# Altium project MiniPC MB GOST.PrjPcb (part 3 of 31)

## Sheet DRAM DDR4 Bank 2 Connector.SchDoc
size 594 x 420 mm; Author: ALTIUM GOSTBOM2.0 KEV; SheetNumber: 7; SheetTotal: 48
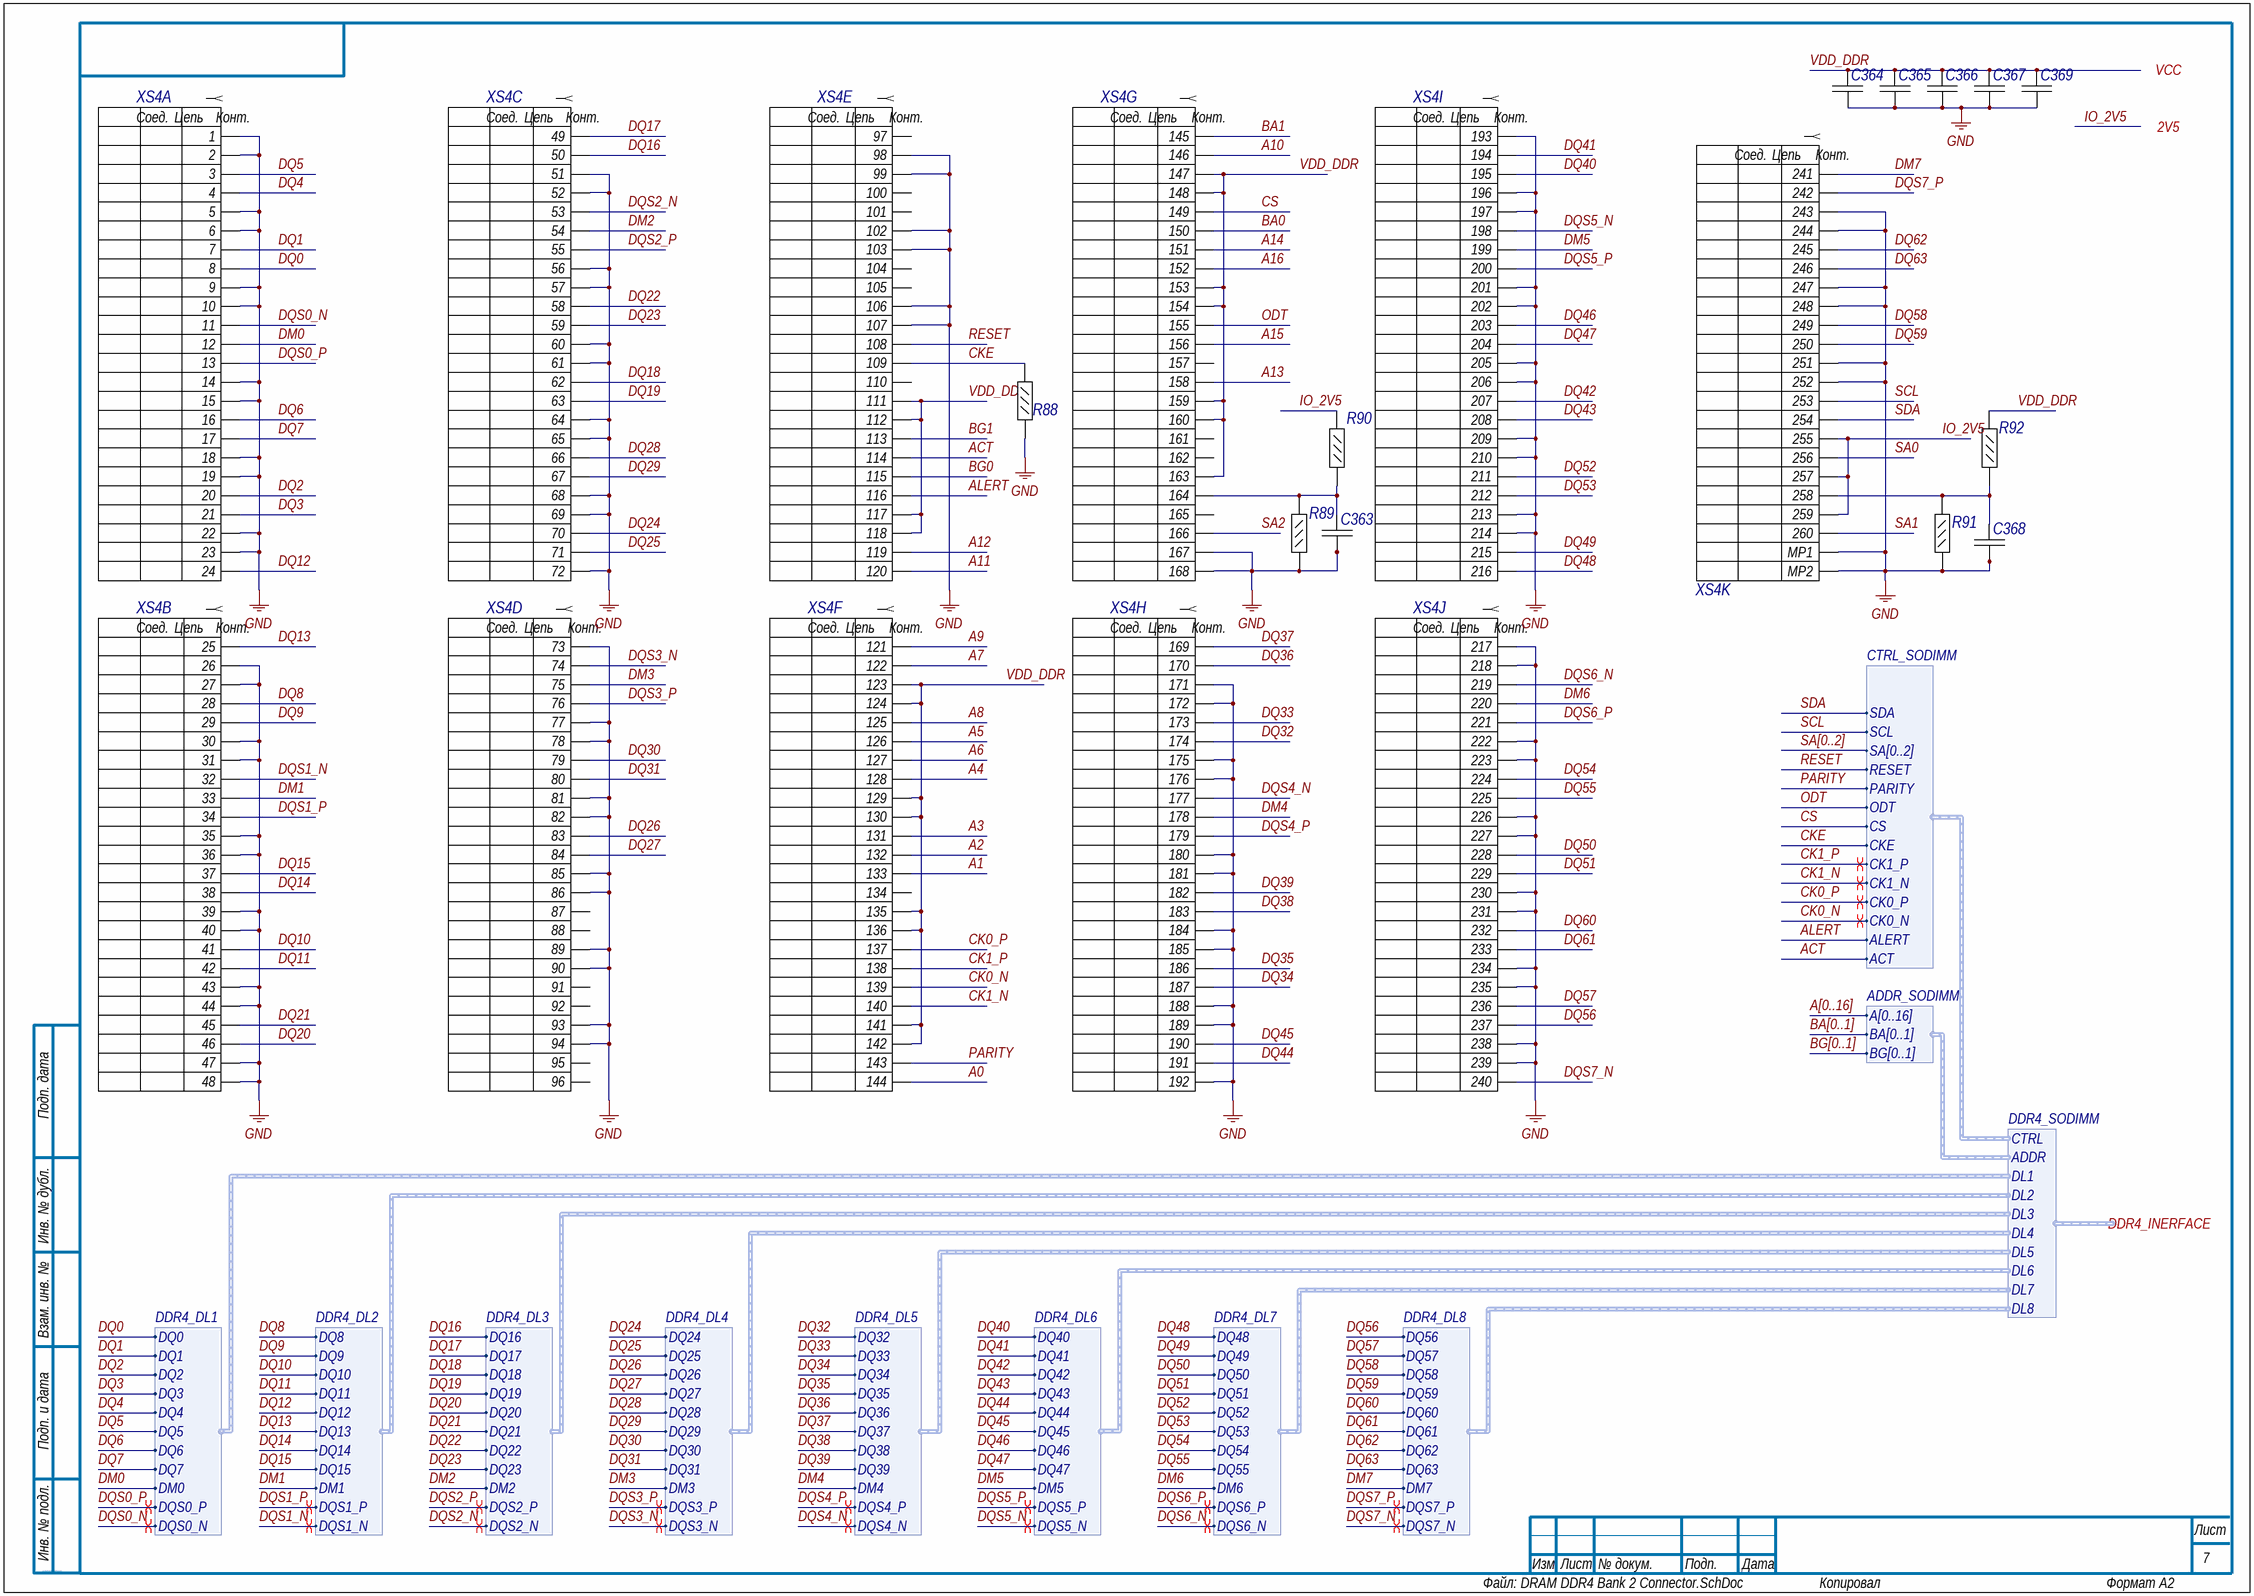
[diagram p4: DRAM DDR4 Bank 2 Connector.SchDoc]

### Parts
C363  C1005X7R1E104M  [CAPC1005X55X10LL05]  (value not drawn)
C364  C1005X7R1E104M  [CAPC1005X55X10LL05]  (value not drawn)
C365  C1005X7R1E104M  [CAPC1005X55X10LL05]  (value not drawn)
C366  C1005X7R1E104M  [CAPC1005X55X10LL05]  (value not drawn)
C367  C1005X7R1E104M  [CAPC1005X55X10LL05]  (value not drawn)
C368  C1005X7R1E104M  [CAPC1005X55X10LL05]  (value not drawn)
C369  C1005X7R1E104M  [CAPC1005X55X10LL05]  (value not drawn)
R88  RC0402JR-0739RL  [RESC1005X40X25LL05T05]  (value not drawn)
R89  RC0402JR-0739RL  [RESC1005X40X25LL05T05]  (value not drawn)
R90  RC0402JR-0739RL  [RESC1005X40X25LL05T05]  (value not drawn)
R91  RC0402JR-0739RL  [RESC1005X40X25LL05T05]  (value not drawn)
R92  RC0402JR-0739RL  [RESC1005X40X25LL05T05]  (value not drawn)
XS4  AS0A823-H4SB-7H  [FOXC-AS0A823-H4SB-7H_V]  (value not drawn)  (parts A,B,C,D,E,F,G,H,I,J,K of 11)

### Ports
2V5, DDR4_INERFACE (harness DDR4_SODIMM), VCC

### Harnesses
DDR4_DL1: DQ0, DQ1, DQ2, DQ3, DQ4, DQ5, DQ6, DQ7, DM0, DQS0_P, DQS0_N
DDR4_DL2: DQ8, DQ9, DQ10, DQ11, DQ12, DQ13, DQ14, DQ15, DM1, DQS1_P, DQS1_N
DDR4_DL3: DQ16, DQ17, DQ18, DQ19, DQ20, DQ21, DQ22, DQ23, DM2, DQS2_P, DQS2_N
DDR4_DL4: DQ24, DQ25, DQ26, DQ27, DQ28, DQ29, DQ30, DQ31, DM3, DQS3_P, DQS3_N
DDR4_DL5: DQ32, DQ33, DQ34, DQ35, DQ36, DQ37, DQ38, DQ39, DM4, DQS4_P, DQS4_N
DDR4_DL6: DQ40, DQ41, DQ42, DQ43, DQ44, DQ45, DQ46, DQ47, DM5, DQS5_P, DQS5_N
DDR4_DL7: DQ48, DQ49, DQ50, DQ51, DQ52, DQ53, DQ54, DQ55, DM6, DQS6_P, DQS6_N
DDR4_DL8: DQ56, DQ57, DQ58, DQ59, DQ60, DQ61, DQ62, DQ63, DM7, DQS7_P, DQS7_N
DDR4_SODIMM: CTRL, ADDR, DL1, DL2, DL3, DL4, DL5, DL6, DL7, DL8
CTRL_SODIMM: SDA, SCL, SA[0..2], RESET, PARITY, ODT, CS, CKE, CK1_P, CK1_N, CK0_P, CK0_N, ALERT, ACT
ADDR_SODIMM: A[0..16], BA[0..1], BG[0..1]

### Nets
GND: C363.2 C364.2 C365.2 C366.2 C367.2 C368.2 C369.2 R88.1 R89.1 R91.1 XS4.1 XS4.2 XS4.5 XS4.6 XS4.9 XS4.10 XS4.14 XS4.15 XS4.18 XS4.19 XS4.22 XS4.23 XS4.26 XS4.27 XS4.30 XS4.31 XS4.35 XS4.36 XS4.39 XS4.40 XS4.43 XS4.44 XS4.47 XS4.48 XS4.51 XS4.52 XS4.56 XS4.57 XS4.60 XS4.61 XS4.64 XS4.65 XS4.68 XS4.69 XS4.72 XS4.73 XS4.77 XS4.78 XS4.81 XS4.82 XS4.85 XS4.86 XS4.89 XS4.90 XS4.93 XS4.94 XS4.98 XS4.99 XS4.102 XS4.103 XS4.106 XS4.107 XS4.167 XS4.168 XS4.171 XS4.172 XS4.175 XS4.176 XS4.180 XS4.181 XS4.184 XS4.185 XS4.188 XS4.189 XS4.192 XS4.193 XS4.196 XS4.197 XS4.201 XS4.202 XS4.205 XS4.206 XS4.209 XS4.210 XS4.213 XS4.214 XS4.217 XS4.218 XS4.222 XS4.223 XS4.226 XS4.227 XS4.230 XS4.231 XS4.234 XS4.235 XS4.238 XS4.239 XS4.243 XS4.244 XS4.247 XS4.248 XS4.251 XS4.252 XS4.MP1 XS4.MP2
A0: XS4.144  [project net A0_7]
A1: XS4.133  [project net A1_7]
A2: XS4.132  [project net A2_7]
A3: XS4.131  [project net A3_7]
A4: XS4.128  [project net A4_7]
A5: XS4.126  [project net A5_7]
A6: XS4.127  [project net A6_7]
A7: XS4.122  [project net A7_7]
A8: XS4.125  [project net A8_7]
A9: XS4.121  [project net A9_7]
A10: XS4.146  [project net A10_7]
A11: XS4.120  [project net A11_7]
A12: XS4.119  [project net A12_7]
A13: XS4.158  [project net A13_7]
A14: XS4.151  [project net A14_7]
A15: XS4.156  [project net A15_7]
A16: XS4.152  [project net A16_7]
ACT: XS4.114 ; harness CTRL_SODIMM.ACT
ALERT: XS4.116 ; harness CTRL_SODIMM.ALERT
BA0: XS4.150  [project net BA0_7]
BA1: XS4.145  [project net BA1_7]
BG0: XS4.115  [project net BG0_7]
BG1: XS4.113  [project net BG1_7]
CK0_N: XS4.139 ; harness CTRL_SODIMM.CK0_N
CK0_P: XS4.137 ; harness CTRL_SODIMM.CK0_P
CK1_N: XS4.140 ; harness CTRL_SODIMM.CK1_N
CK1_P: XS4.138 ; harness CTRL_SODIMM.CK1_P
CKE: R88.2 XS4.109 ; harness CTRL_SODIMM.CKE
CS: XS4.149 ; harness CTRL_SODIMM.CS
DM0: XS4.12 ; harness DDR4_DL1.DM0
DM1: XS4.33 ; harness DDR4_DL2.DM1
DM2: XS4.54 ; harness DDR4_DL3.DM2
DM3: XS4.75 ; harness DDR4_DL4.DM3
DM4: XS4.178 ; harness DDR4_DL5.DM4
DM5: XS4.199 ; harness DDR4_DL6.DM5
DM6: XS4.220 ; harness DDR4_DL7.DM6
DM7: XS4.241 ; harness DDR4_DL8.DM7
DQ0: XS4.8 ; harness DDR4_DL1.DQ0
DQ1: XS4.7 ; harness DDR4_DL1.DQ1
DQ2: XS4.20 ; harness DDR4_DL1.DQ2
DQ3: XS4.21 ; harness DDR4_DL1.DQ3
DQ4: XS4.4 ; harness DDR4_DL1.DQ4
DQ5: XS4.3 ; harness DDR4_DL1.DQ5
DQ6: XS4.16 ; harness DDR4_DL1.DQ6
DQ7: XS4.17 ; harness DDR4_DL1.DQ7
DQ8: XS4.28 ; harness DDR4_DL2.DQ8
DQ9: XS4.29 ; harness DDR4_DL2.DQ9
DQ10: XS4.41 ; harness DDR4_DL2.DQ10
DQ11: XS4.42 ; harness DDR4_DL2.DQ11
DQ12: XS4.24 ; harness DDR4_DL2.DQ12
DQ13: XS4.25 ; harness DDR4_DL2.DQ13
DQ14: XS4.38 ; harness DDR4_DL2.DQ14
DQ15: XS4.37 ; harness DDR4_DL2.DQ15
DQ16: XS4.50 ; harness DDR4_DL3.DQ16
DQ17: XS4.49 ; harness DDR4_DL3.DQ17
DQ18: XS4.62 ; harness DDR4_DL3.DQ18
DQ19: XS4.63 ; harness DDR4_DL3.DQ19
DQ20: XS4.46 ; harness DDR4_DL3.DQ20
DQ21: XS4.45 ; harness DDR4_DL3.DQ21
DQ22: XS4.58 ; harness DDR4_DL3.DQ22
DQ23: XS4.59 ; harness DDR4_DL3.DQ23
DQ24: XS4.70 ; harness DDR4_DL4.DQ24
DQ25: XS4.71 ; harness DDR4_DL4.DQ25
DQ26: XS4.83 ; harness DDR4_DL4.DQ26
DQ27: XS4.84 ; harness DDR4_DL4.DQ27
DQ28: XS4.66 ; harness DDR4_DL4.DQ28
DQ29: XS4.67 ; harness DDR4_DL4.DQ29
DQ30: XS4.79 ; harness DDR4_DL4.DQ30
DQ31: XS4.80 ; harness DDR4_DL4.DQ31
DQ32: XS4.174 ; harness DDR4_DL5.DQ32
DQ33: XS4.173 ; harness DDR4_DL5.DQ33
DQ34: XS4.187 ; harness DDR4_DL5.DQ34
DQ35: XS4.186 ; harness DDR4_DL5.DQ35
DQ36: XS4.170 ; harness DDR4_DL5.DQ36
DQ37: XS4.169 ; harness DDR4_DL5.DQ37
DQ38: XS4.183 ; harness DDR4_DL5.DQ38
DQ39: XS4.182 ; harness DDR4_DL5.DQ39
DQ40: XS4.195 ; harness DDR4_DL6.DQ40
DQ41: XS4.194 ; harness DDR4_DL6.DQ41
DQ42: XS4.207 ; harness DDR4_DL6.DQ42
DQ43: XS4.208 ; harness DDR4_DL6.DQ43
DQ44: XS4.191 ; harness DDR4_DL6.DQ44
DQ45: XS4.190 ; harness DDR4_DL6.DQ45
DQ46: XS4.203 ; harness DDR4_DL6.DQ46
DQ47: XS4.204 ; harness DDR4_DL6.DQ47
DQ48: XS4.216 ; harness DDR4_DL7.DQ48
DQ49: XS4.215 ; harness DDR4_DL7.DQ49
DQ50: XS4.228 ; harness DDR4_DL7.DQ50
DQ51: XS4.229 ; harness DDR4_DL7.DQ51
DQ52: XS4.211 ; harness DDR4_DL7.DQ52
DQ53: XS4.212 ; harness DDR4_DL7.DQ53
DQ54: XS4.224 ; harness DDR4_DL7.DQ54
DQ55: XS4.225 ; harness DDR4_DL7.DQ55
DQ56: XS4.237 ; harness DDR4_DL8.DQ56
DQ57: XS4.236 ; harness DDR4_DL8.DQ57
DQ58: XS4.249 ; harness DDR4_DL8.DQ58
DQ59: XS4.250 ; harness DDR4_DL8.DQ59
DQ60: XS4.232 ; harness DDR4_DL8.DQ60
DQ61: XS4.233 ; harness DDR4_DL8.DQ61
DQ62: XS4.245 ; harness DDR4_DL8.DQ62
DQ63: XS4.246 ; harness DDR4_DL8.DQ63
DQS0_N: XS4.11 ; harness DDR4_DL1.DQS0_N
DQS0_P: XS4.13 ; harness DDR4_DL1.DQS0_P
DQS1_N: XS4.32 ; harness DDR4_DL2.DQS1_N
DQS1_P: XS4.34 ; harness DDR4_DL2.DQS1_P
DQS2_N: XS4.53 ; harness DDR4_DL3.DQS2_N
DQS2_P: XS4.55 ; harness DDR4_DL3.DQS2_P
DQS3_N: XS4.74 ; harness DDR4_DL4.DQS3_N
DQS3_P: XS4.76 ; harness DDR4_DL4.DQS3_P
DQS4_N: XS4.177 ; harness DDR4_DL5.DQS4_N
DQS4_P: XS4.179 ; harness DDR4_DL5.DQS4_P
DQS5_N: XS4.198 ; harness DDR4_DL6.DQS5_N
DQS5_P: XS4.200 ; harness DDR4_DL6.DQS5_P
DQS6_N: XS4.219 ; harness DDR4_DL7.DQS6_N
DQS6_P: XS4.221 ; harness DDR4_DL7.DQS6_P
DQS7_N: XS4.240 ; harness DDR4_DL8.DQS7_N
DQS7_P: XS4.242 ; harness DDR4_DL8.DQS7_P
IO_2V5: R90.1 XS4.255 XS4.257 XS4.259 ; port 2V5
ODT: XS4.155 ; harness CTRL_SODIMM.ODT
PARITY: XS4.143 ; harness CTRL_SODIMM.PARITY
RESET: XS4.108 ; harness CTRL_SODIMM.RESET
SA0: XS4.256  [project net SA0_7]
SA1: XS4.260  [project net SA1_7]
SA2: XS4.166  [project net SA2_7]
SCL: XS4.253 ; harness CTRL_SODIMM.SCL
SDA: XS4.254 ; harness CTRL_SODIMM.SDA
VDD_DDR: C364.1 C365.1 C366.1 C367.1 C369.1 R92.1 XS4.111 XS4.112 XS4.117 XS4.118 XS4.123 XS4.124 XS4.129 XS4.130 XS4.135 XS4.136 XS4.141 XS4.142 XS4.147 XS4.148 XS4.153 XS4.154 XS4.159 XS4.160 XS4.163 ; port VCC  [project net DDR4VCC]
NetC363_1: C363.1 R89.2 R90.2 XS4.164
NetC368_1: C368.1 R91.2 R92.2 XS4.258

Not connected (* = marked no-connect by the designer): XS4 87 88 91 92 95 96 97 100 101 104 105 110 134 157 161 162 165

### Buses and harness runs
bus A[0..16]
bus BA[0..1]
bus BG[0..1]
bus SA[0..2]

### Layout directives
differential pair: CK0_N, CK0_P, CK1_N, CK1_P, DQS0_N, DQS0_P, DQS1_N, DQS1_P, DQS2_N, DQS2_P, DQS3_N, DQS3_P, DQS4_N, DQS4_P, DQS5_N, DQS5_P, DQS6_N, DQS6_P, DQS7_N, DQS7_P

### Notes on the sheet
- Подп. дата
- Инв. № дубл.
- Взам. инв. №
- Подп. и дата
- Инв. № подл.
- Изм.
- Лист
- № докум.
- Подп.
- Дата
- ALTIUM GOSTBOM2.0 KEV
- Файл:
- Копировал
- Формат А2
- (in symbol E43, part A) Соед.; Цепь; Конт.
- (in symbol E43, part B) Соед.; Цепь; Конт.
- (in symbol E43, part C) Соед.; Цепь; Конт.
- (in symbol E43, part D) Соед.; Цепь; Конт.
- (in symbol E43, part E) Соед.; Цепь; Конт.
- (in symbol E43, part F) Соед.; Цепь; Конт.
- (in symbol E43, part G) Соед.; Цепь; Конт.
- (in symbol E43, part H) Соед.; Цепь; Конт.
- (in symbol E43, part I) Соед.; Цепь; Конт.
- (in symbol E43, part J) Соед.; Цепь; Конт.
- (in symbol E43, part K) Соед.; Цепь; Конт.

### Library data of the parts
C363 = E11: Chip Capacitor, 0.1 uF, +/- 20%, 25 V, -55 to 125 degC, 0402 (1005 Metric), RoHS, Tape and Reel; Тип элемента: Конденсатор; Capacitance: 100 nF; Case\/Package: 0402; Type (Capacitors): X7R; Voltage Rating: 25 V; Old_des: C295; New_des: C372; UID: E11; Component Kind: Standard; Case Code (Imperial): 0402; Case Code (Metric): 1005; ComponentLink1Description: Manufacturer URL; ComponentLink1URL: http://www.tdk.com/; ComponentLink2Description: Datasheet; ComponentLink2URL: http://www.farnell.com/datasheets/1571323.pdf; DatasheetVersion: 09/2011; Length: 1 mm; Max Operating Temperature: 125 degC; Min Operating Temperature: -55 degC; Mounting Technology: Surface Mount; Package Quantity: 10000; PackageDescription: 2-Pin Surface Mount Device, Body 1 x 0.5 mm; Packaging: Tape and Reel; PartNumber: C1005X7R1E104M; RoHSCompliant: true; Tolerance: 20%; Width: 0.5 mm; Height: 0.5 mm; Mount: Surface Mount; PackageReference: 0402; Pins: 2; Voltage Rating (DC): 25 V
C364 = E11: Chip Capacitor, 0.1 uF, +/- 20%, 25 V, -55 to 125 degC, 0402 (1005 Metric), RoHS, Tape and Reel; Тип элемента: Конденсатор; Capacitance: 100 nF; Case\/Package: 0402; Type (Capacitors): X7R; Voltage Rating: 25 V; Old_des: C290; New_des: C373; UID: E11; Component Kind: Standard; Case Code (Imperial): 0402; Case Code (Metric): 1005; ComponentLink1Description: Manufacturer URL; ComponentLink1URL: http://www.tdk.com/; ComponentLink2Description: Datasheet; ComponentLink2URL: http://www.farnell.com/datasheets/1571323.pdf; DatasheetVersion: 09/2011; Length: 1 mm; Max Operating Temperature: 125 degC; Min Operating Temperature: -55 degC; Mounting Technology: Surface Mount; Package Quantity: 10000; PackageDescription: 2-Pin Surface Mount Device, Body 1 x 0.5 mm; Packaging: Tape and Reel; PartNumber: C1005X7R1E104M; RoHSCompliant: true; Tolerance: 20%; Width: 0.5 mm; Height: 0.5 mm; Mount: Surface Mount; PackageReference: 0402; Pins: 2; Voltage Rating (DC): 25 V
C365 = E11: Chip Capacitor, 0.1 uF, +/- 20%, 25 V, -55 to 125 degC, 0402 (1005 Metric), RoHS, Tape and Reel; Тип элемента: Конденсатор; Capacitance: 100 nF; Case\/Package: 0402; Type (Capacitors): X7R; Voltage Rating: 25 V; Old_des: C291; New_des: C374; UID: E11; Component Kind: Standard; Case Code (Imperial): 0402; Case Code (Metric): 1005; ComponentLink1Description: Manufacturer URL; ComponentLink1URL: http://www.tdk.com/; ComponentLink2Description: Datasheet; ComponentLink2URL: http://www.farnell.com/datasheets/1571323.pdf; DatasheetVersion: 09/2011; Length: 1 mm; Max Operating Temperature: 125 degC; Min Operating Temperature: -55 degC; Mounting Technology: Surface Mount; Package Quantity: 10000; PackageDescription: 2-Pin Surface Mount Device, Body 1 x 0.5 mm; Packaging: Tape and Reel; PartNumber: C1005X7R1E104M; RoHSCompliant: true; Tolerance: 20%; Width: 0.5 mm; Height: 0.5 mm; Mount: Surface Mount; PackageReference: 0402; Pins: 2; Voltage Rating (DC): 25 V
C366 = E11: Chip Capacitor, 0.1 uF, +/- 20%, 25 V, -55 to 125 degC, 0402 (1005 Metric), RoHS, Tape and Reel; Тип элемента: Конденсатор; Capacitance: 100 nF; Case\/Package: 0402; Type (Capacitors): X7R; Voltage Rating: 25 V; Old_des: C292; New_des: C375; UID: E11; Component Kind: Standard; Case Code (Imperial): 0402; Case Code (Metric): 1005; ComponentLink1Description: Manufacturer URL; ComponentLink1URL: http://www.tdk.com/; ComponentLink2Description: Datasheet; ComponentLink2URL: http://www.farnell.com/datasheets/1571323.pdf; DatasheetVersion: 09/2011; Length: 1 mm; Max Operating Temperature: 125 degC; Min Operating Temperature: -55 degC; Mounting Technology: Surface Mount; Package Quantity: 10000; PackageDescription: 2-Pin Surface Mount Device, Body 1 x 0.5 mm; Packaging: Tape and Reel; PartNumber: C1005X7R1E104M; RoHSCompliant: true; Tolerance: 20%; Width: 0.5 mm; Height: 0.5 mm; Mount: Surface Mount; PackageReference: 0402; Pins: 2; Voltage Rating (DC): 25 V
C367 = E11: Chip Capacitor, 0.1 uF, +/- 20%, 25 V, -55 to 125 degC, 0402 (1005 Metric), RoHS, Tape and Reel; Тип элемента: Конденсатор; Capacitance: 100 nF; Case\/Package: 0402; Type (Capacitors): X7R; Voltage Rating: 25 V; Old_des: C293; New_des: C376; UID: E11; Component Kind: Standard; Case Code (Imperial): 0402; Case Code (Metric): 1005; ComponentLink1Description: Manufacturer URL; ComponentLink1URL: http://www.tdk.com/; ComponentLink2Description: Datasheet; ComponentLink2URL: http://www.farnell.com/datasheets/1571323.pdf; DatasheetVersion: 09/2011; Length: 1 mm; Max Operating Temperature: 125 degC; Min Operating Temperature: -55 degC; Mounting Technology: Surface Mount; Package Quantity: 10000; PackageDescription: 2-Pin Surface Mount Device, Body 1 x 0.5 mm; Packaging: Tape and Reel; PartNumber: C1005X7R1E104M; RoHSCompliant: true; Tolerance: 20%; Width: 0.5 mm; Height: 0.5 mm; Mount: Surface Mount; PackageReference: 0402; Pins: 2; Voltage Rating (DC): 25 V
C368 = E11: Chip Capacitor, 0.1 uF, +/- 20%, 25 V, -55 to 125 degC, 0402 (1005 Metric), RoHS, Tape and Reel; Тип элемента: Конденсатор; Capacitance: 100 nF; Case\/Package: 0402; Type (Capacitors): X7R; Voltage Rating: 25 V; Old_des: C296; New_des: C377; UID: E11; Component Kind: Standard; Case Code (Imperial): 0402; Case Code (Metric): 1005; ComponentLink1Description: Manufacturer URL; ComponentLink1URL: http://www.tdk.com/; ComponentLink2Description: Datasheet; ComponentLink2URL: http://www.farnell.com/datasheets/1571323.pdf; DatasheetVersion: 09/2011; Length: 1 mm; Max Operating Temperature: 125 degC; Min Operating Temperature: -55 degC; Mounting Technology: Surface Mount; Package Quantity: 10000; PackageDescription: 2-Pin Surface Mount Device, Body 1 x 0.5 mm; Packaging: Tape and Reel; PartNumber: C1005X7R1E104M; RoHSCompliant: true; Tolerance: 20%; Width: 0.5 mm; Height: 0.5 mm; Mount: Surface Mount; PackageReference: 0402; Pins: 2; Voltage Rating (DC): 25 V
C369 = E11: Chip Capacitor, 0.1 uF, +/- 20%, 25 V, -55 to 125 degC, 0402 (1005 Metric), RoHS, Tape and Reel; Тип элемента: Конденсатор; Capacitance: 100 nF; Case\/Package: 0402; Type (Capacitors): X7R; Voltage Rating: 25 V; Old_des: C294; New_des: C378; UID: E11; Component Kind: Standard; Case Code (Imperial): 0402; Case Code (Metric): 1005; ComponentLink1Description: Manufacturer URL; ComponentLink1URL: http://www.tdk.com/; ComponentLink2Description: Datasheet; ComponentLink2URL: http://www.farnell.com/datasheets/1571323.pdf; DatasheetVersion: 09/2011; Length: 1 mm; Max Operating Temperature: 125 degC; Min Operating Temperature: -55 degC; Mounting Technology: Surface Mount; Package Quantity: 10000; PackageDescription: 2-Pin Surface Mount Device, Body 1 x 0.5 mm; Packaging: Tape and Reel; PartNumber: C1005X7R1E104M; RoHSCompliant: true; Tolerance: 20%; Width: 0.5 mm; Height: 0.5 mm; Mount: Surface Mount; PackageReference: 0402; Pins: 2; Voltage Rating (DC): 25 V
R88 = E97: Chip Resistor, 39 Ohm, +/- 5%, 0.063 W, -55 to 155 degC, 0402 (1005 Metric), RoHS, Tape and Reel; Тип элемента: Резистор; Voltage Rating: 50 V; Power Rating: 63 mW; Resistance: 39 Ohm; Old_des: R236; New_des: R107; UID: E97; Component Kind: Standard; Case Code (Imperial): 0402; Case Code (Metric): 1005; Case/Package: 0402; ComponentLink1Description: Manufacturer URL; ComponentLink1URL: http://www.yageo.com/; ComponentLink2Description: Datasheet; ComponentLink2URL: http://www.yageo.com/documents/recent/PYu-RC_Group_51_RoHS_L_04.pdf; DatasheetVersion: Rev. 4, 02/2016; Length: 1 mm; Max Operating Temperature: 155 degC; Min Operating Temperature: -55 degC; Mounting Technology: Surface Mount; Package Quantity: 1; PackageDescription: 2-Pin Surface Mount Device, Body 1 x 0.5 mm; Packaging: Cut Tape; PartNumber: RC0402JR-0739RL; RoHSCompliant: true; Tolerance: 5%; Width: 0.5 mm; Height: 0.35 mm; Mount: Surface Mount; Pins: 2; REACH SVHC: No SVHC; Voltage Rating (DC): 50 V
R89 = E97: Chip Resistor, 39 Ohm, +/- 5%, 0.063 W, -55 to 155 degC, 0402 (1005 Metric), RoHS, Tape and Reel; Тип элемента: Резистор; Voltage Rating: 50 V; Power Rating: 63 mW; Resistance: 39 Ohm; Old_des: R233; New_des: R108; UID: E97; Component Kind: Standard; Case Code (Imperial): 0402; Case Code (Metric): 1005; Case/Package: 0402; ComponentLink1Description: Manufacturer URL; ComponentLink1URL: http://www.yageo.com/; ComponentLink2Description: Datasheet; ComponentLink2URL: http://www.yageo.com/documents/recent/PYu-RC_Group_51_RoHS_L_04.pdf; DatasheetVersion: Rev. 4, 02/2016; Length: 1 mm; Max Operating Temperature: 155 degC; Min Operating Temperature: -55 degC; Mounting Technology: Surface Mount; Package Quantity: 1; PackageDescription: 2-Pin Surface Mount Device, Body 1 x 0.5 mm; Packaging: Cut Tape; PartNumber: RC0402JR-0739RL; RoHSCompliant: true; Tolerance: 5%; Width: 0.5 mm; Height: 0.35 mm; Mount: Surface Mount; Pins: 2; REACH SVHC: No SVHC; Voltage Rating (DC): 50 V
R90 = E97: Chip Resistor, 39 Ohm, +/- 5%, 0.063 W, -55 to 155 degC, 0402 (1005 Metric), RoHS, Tape and Reel; Тип элемента: Резистор; Voltage Rating: 50 V; Power Rating: 63 mW; Resistance: 39 Ohm; Old_des: R232; New_des: R109; UID: E97; Component Kind: Standard; Case Code (Imperial): 0402; Case Code (Metric): 1005; Case/Package: 0402; ComponentLink1Description: Manufacturer URL; ComponentLink1URL: http://www.yageo.com/; ComponentLink2Description: Datasheet; ComponentLink2URL: http://www.yageo.com/documents/recent/PYu-RC_Group_51_RoHS_L_04.pdf; DatasheetVersion: Rev. 4, 02/2016; Length: 1 mm; Max Operating Temperature: 155 degC; Min Operating Temperature: -55 degC; Mounting Technology: Surface Mount; Package Quantity: 1; PackageDescription: 2-Pin Surface Mount Device, Body 1 x 0.5 mm; Packaging: Cut Tape; PartNumber: RC0402JR-0739RL; RoHSCompliant: true; Tolerance: 5%; Width: 0.5 mm; Height: 0.35 mm; Mount: Surface Mount; Pins: 2; REACH SVHC: No SVHC; Voltage Rating (DC): 50 V
R91 = E97: Chip Resistor, 39 Ohm, +/- 5%, 0.063 W, -55 to 155 degC, 0402 (1005 Metric), RoHS, Tape and Reel; Тип элемента: Резистор; Voltage Rating: 50 V; Power Rating: 63 mW; Resistance: 39 Ohm; Old_des: R235; New_des: R110; UID: E97; Component Kind: Standard; Case Code (Imperial): 0402; Case Code (Metric): 1005; Case/Package: 0402; ComponentLink1Description: Manufacturer URL; ComponentLink1URL: http://www.yageo.com/; ComponentLink2Description: Datasheet; ComponentLink2URL: http://www.yageo.com/documents/recent/PYu-RC_Group_51_RoHS_L_04.pdf; DatasheetVersion: Rev. 4, 02/2016; Length: 1 mm; Max Operating Temperature: 155 degC; Min Operating Temperature: -55 degC; Mounting Technology: Surface Mount; Package Quantity: 1; PackageDescription: 2-Pin Surface Mount Device, Body 1 x 0.5 mm; Packaging: Cut Tape; PartNumber: RC0402JR-0739RL; RoHSCompliant: true; Tolerance: 5%; Width: 0.5 mm; Height: 0.35 mm; Mount: Surface Mount; Pins: 2; REACH SVHC: No SVHC; Voltage Rating (DC): 50 V
R92 = E97: Chip Resistor, 39 Ohm, +/- 5%, 0.063 W, -55 to 155 degC, 0402 (1005 Metric), RoHS, Tape and Reel; Тип элемента: Резистор; Voltage Rating: 50 V; Power Rating: 63 mW; Resistance: 39 Ohm; Old_des: R234; New_des: R111; UID: E97; Component Kind: Standard; Case Code (Imperial): 0402; Case Code (Metric): 1005; Case/Package: 0402; ComponentLink1Description: Manufacturer URL; ComponentLink1URL: http://www.yageo.com/; ComponentLink2Description: Datasheet; ComponentLink2URL: http://www.yageo.com/documents/recent/PYu-RC_Group_51_RoHS_L_04.pdf; DatasheetVersion: Rev. 4, 02/2016; Length: 1 mm; Max Operating Temperature: 155 degC; Min Operating Temperature: -55 degC; Mounting Technology: Surface Mount; Package Quantity: 1; PackageDescription: 2-Pin Surface Mount Device, Body 1 x 0.5 mm; Packaging: Cut Tape; PartNumber: RC0402JR-0739RL; RoHSCompliant: true; Tolerance: 5%; Width: 0.5 mm; Height: 0.35 mm; Mount: Surface Mount; Pins: 2; REACH SVHC: No SVHC; Voltage Rating (DC): 50 V
XS4 = E43: Surface Mount Horizontal Type DDR4 DIMM Socket Connector, 260 Position, Pitch 0.5 mm, -55 to 85 degC, Halogen/Lead Free, Tape and Reel; Тип элемента: Соединитель; Old_des: J20; New_des: XS4; UID: E43; Component Kind: Standard; ComponentLink1Description: Manufacturer URL; ComponentLink1URL: http://www.foxconn.com/; ComponentLink2Description: Datasheet; ComponentLink2URL: https://datasheet.octopart.com/AS0A823-H4SB-7H-Foxconn-datasheet-34149518.pdf; DatasheetVersion: Rev. A, 10/2013; Mounting Technology: Surface Mount; PackageDescription: 260-Pin Surface Mount Device, Body Length 73.1 mm, Pitch 0.5 mm; PartNumber: AS0A823-H4SB-7H; System: Connector

## Sheet Supply Sources Group.SchDoc
size 420 x 297 mm; Author: ALTIUM GOSTBOM2.0 KEV; SheetNumber: 32; SheetTotal: 48
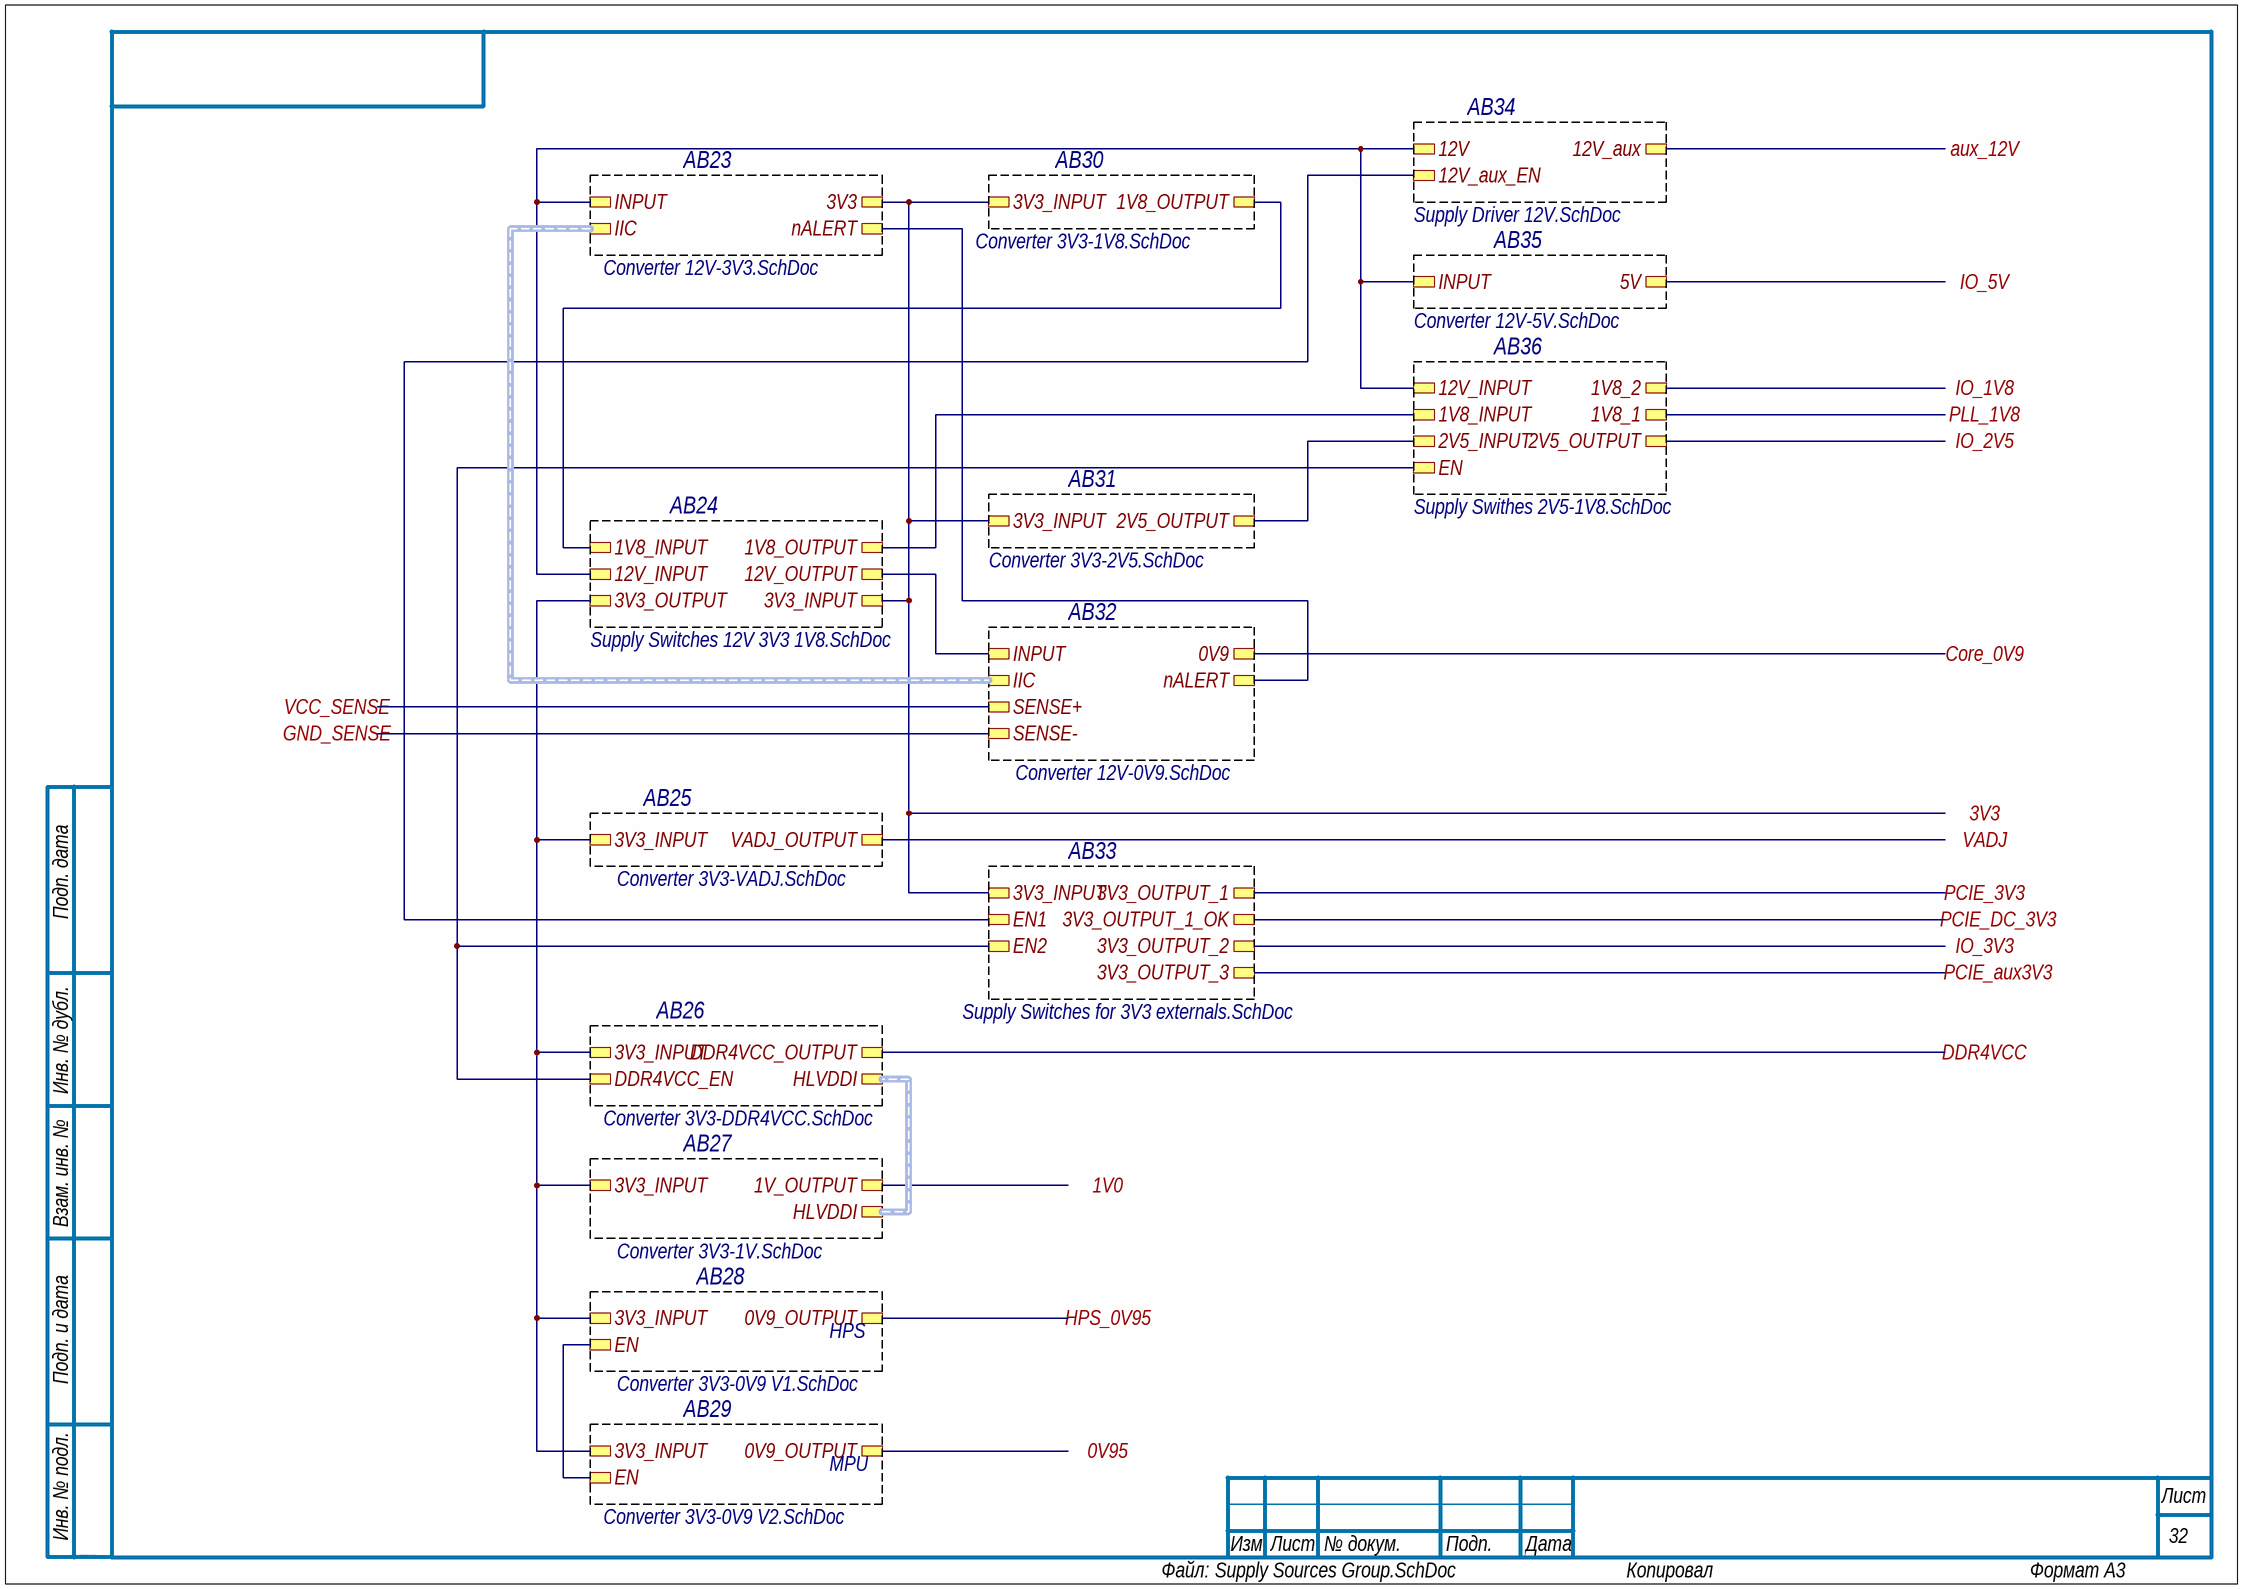
[diagram p5: Supply Sources Group.SchDoc]

### Sub-sheets
AB23 = Converter 12V-3V3.SchDoc: IIC (harness IIC), INPUT, 3V3, nALERT
AB24 = Supply Switches 12V 3V3 1V8.SchDoc: 12V_INPUT, 3V3_INPUT, 3V3_OUTPUT, 12V_OUTPUT, 1V8_OUTPUT, 1V8_INPUT
AB25 = Converter 3V3-VADJ.SchDoc: 3V3_INPUT, VADJ_OUTPUT
AB26 = Converter 3V3-DDR4VCC.SchDoc: HLVDDI (harness DIFFPAIR), DDR4VCC_OUTPUT, 3V3_INPUT, DDR4VCC_EN
AB27 = Converter 3V3-1V.SchDoc: HLVDDI (harness DIFFPAIR), 1V_OUTPUT, 3V3_INPUT
AB28 = Converter 3V3-0V9 V1.SchDoc: 3V3_INPUT, 0V9_OUTPUT, EN  | Load: HPS
AB29 = Converter 3V3-0V9 V2.SchDoc: 3V3_INPUT, EN, 0V9_OUTPUT  | Load: MPU
AB30 = Converter 3V3-1V8.SchDoc: 1V8_OUTPUT, 3V3_INPUT
AB31 = Converter 3V3-2V5.SchDoc: 2V5_OUTPUT, 3V3_INPUT
AB32 = Converter 12V-0V9.SchDoc: IIC (harness IIC), 0V9, nALERT, INPUT, SENSE-, SENSE+
AB33 = Supply Switches for 3V3 externals.SchDoc: 3V3_OUTPUT_2, 3V3_OUTPUT_1_OK, 3V3_OUTPUT_3, EN1, 3V3_INPUT, 3V3_OUTPUT_1, EN2
AB34 = Supply Driver 12V.SchDoc: 12V_aux_EN, 12V, 12V_aux
AB35 = Converter 12V-5V.SchDoc: INPUT, 5V
AB36 = Supply Swithes 2V5-1V8.SchDoc: EN, 12V_INPUT, 2V5_INPUT, 2V5_OUTPUT, 1V8_1, 1V8_2, 1V8_INPUT

### Ports
0V95, 1V0, 3V3, aux_12V, Core_0V9, DDR4VCC, GND_SENSE, HPS_0V95, IO_1V8, IO_2V5, IO_3V3, IO_5V, PCIE_3V3, PCIE_aux3V3, PCIE_DC_3V3, PLL_1V8, VADJ, VCC_SENSE

### Nets
0V95: port 0V95, sheet AB29/0V9_OUTPUT
1V0: port 1V0, sheet AB27/1V_OUTPUT
3V3: port 3V3, sheet AB23/3V3, sheet AB24/3V3_INPUT, sheet AB30/3V3_INPUT, sheet AB31/3V3_INPUT, sheet AB33/3V3_INPUT
3V3_OUTPUT: sheet AB24/3V3_OUTPUT, sheet AB28/3V3_INPUT, sheet AB27/3V3_INPUT, sheet AB25/3V3_INPUT, sheet AB26/3V3_INPUT, sheet AB29/3V3_INPUT
12V_INPUT: sheet AB23/INPUT, sheet AB35/INPUT, sheet AB24/12V_INPUT, sheet AB34/12V, sheet AB36/12V_INPUT
12V_OUTPUT: sheet AB32/INPUT, sheet AB24/12V_OUTPUT
aux_12V: port aux_12V, sheet AB34/12V_aux
Core_0V9: port Core_0V9, sheet AB32/0V9
DDR4VCC: port DDR4VCC, sheet AB26/DDR4VCC_OUTPUT
GND_SENSE: port GND_SENSE, sheet AB32/SENSE-
HPS_0V95: port HPS_0V95, sheet AB28/0V9_OUTPUT
IO_1V8: port IO_1V8, sheet AB36/1V8_2
IO_2V5: port IO_2V5, sheet AB36/2V5_OUTPUT
IO_3V3: port IO_3V3, sheet AB33/3V3_OUTPUT_2
IO_5V: port IO_5V, sheet AB35/5V
PCIE_aux3V3: port PCIE_aux3V3, sheet AB33/3V3_OUTPUT_3
PCIE_DC_3V3: port PCIE_DC_3V3, sheet AB33/3V3_OUTPUT_1_OK
PLL_1V8: port PLL_1V8, sheet AB36/1V8_1
VADJ: port VADJ, sheet AB25/VADJ_OUTPUT
VCC_SENSE: port VCC_SENSE, sheet AB32/SENSE+
NetC437_2: sheet AB24/1V8_OUTPUT, sheet AB36/1V8_INPUT
NetC537_2: sheet AB36/2V5_INPUT, sheet AB31/2V5_OUTPUT
NetD15_E5: sheet AB23/nALERT, sheet AB32/nALERT
NetR188_2: sheet AB36/EN, sheet AB26/DDR4VCC_EN, sheet AB33/EN2
NetR213_2: sheet AB28/EN, sheet AB29/EN
NetR248_1: sheet AB24/1V8_INPUT, sheet AB30/1V8_OUTPUT
NetR277_2: port PCIE_3V3, sheet AB33/3V3_OUTPUT_1
NetR278_1: sheet AB34/12V_aux_EN, sheet AB33/EN1

### Buses and harness runs
harness sheet AB23/IIC = sheet AB32/IIC
harness sheet AB26/HLVDDI = sheet AB27/HLVDDI

### Notes on the sheet
- Подп. дата
- Инв. № дубл.
- Взам. инв. №
- Подп. и дата
- Инв. № подл.
- Изм.
- Лист
- № докум.
- Подп.
- Дата
- ALTIUM GOSTBOM2.0 KEV
- Файл:
- Копировал
- Формат А3